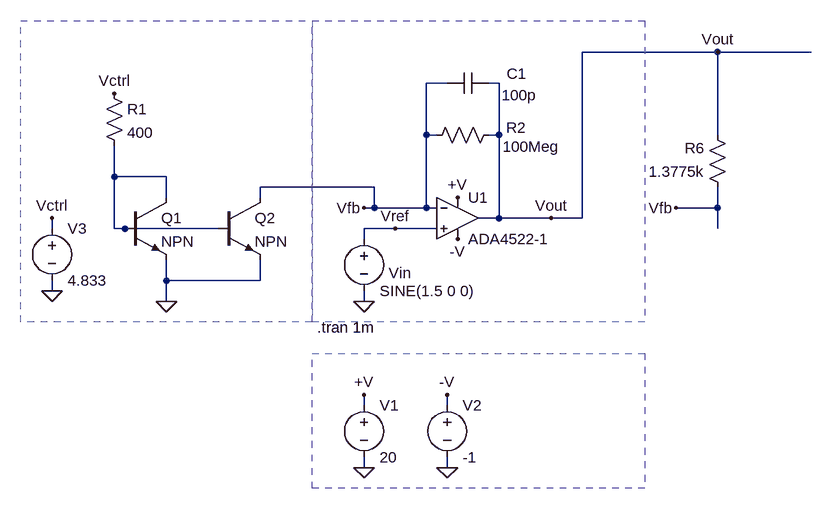
[diagram p0: schematic current_mirror_ctrl_EA.asc]
current_mirror_ctrl_EA.asc, the LTspice schematic file:
Version 4
SHEET 1 1624 700
WIRE 976 -1360 768 -1360
WIRE 1120 -1360 976 -1360
WIRE 560 -1312 528 -1312
WIRE 640 -1312 624 -1312
WIRE 528 -1232 528 -1312
WIRE 544 -1232 528 -1232
WIRE 640 -1232 640 -1312
WIRE 640 -1232 624 -1232
WIRE 976 -1232 976 -1360
WIRE 48 -1168 48 -1216
WIRE 128 -1168 48 -1168
WIRE 448 -1152 272 -1152
WIRE 128 -1136 128 -1168
WIRE 272 -1136 272 -1152
WIRE 448 -1120 448 -1152
WIRE 448 -1120 432 -1120
WIRE 528 -1120 528 -1232
WIRE 528 -1120 448 -1120
WIRE 544 -1120 528 -1120
WIRE 976 -1120 976 -1152
WIRE 976 -1120 912 -1120
WIRE 640 -1104 640 -1232
WIRE 640 -1104 608 -1104
WIRE 720 -1104 640 -1104
WIRE 768 -1104 768 -1360
WIRE 768 -1104 720 -1104
WIRE -48 -1088 -48 -1104
WIRE 48 -1088 48 -1168
WIRE 64 -1088 48 -1088
WIRE 208 -1088 64 -1088
WIRE 480 -1088 432 -1088
WIRE 544 -1088 480 -1088
WIRE 976 -1088 976 -1120
WIRE 432 -1072 432 -1088
WIRE 128 -1008 128 -1040
WIRE 272 -1008 272 -1040
WIRE 272 -1008 128 -1008
WIRE -48 -992 -48 -1008
WIRE 128 -976 128 -1008
WIRE 432 -976 432 -992
WIRE 432 -816 432 -832
WIRE 560 -816 560 -832
WIRE 432 -720 432 -736
WIRE 560 -720 560 -736
FLAG 432 -832 +V
FLAG 432 -720 0
FLAG 432 -976 0
FLAG 576 -1136 +V
FLAG 560 -832 -V
FLAG 576 -1072 -V
FLAG 560 -720 0
FLAG 128 -976 0
FLAG 720 -1104 Vout
FLAG 976 -1360 Vout
FLAG 912 -1120 Vfb
FLAG 48 -1296 Vctrl
FLAG 432 -1120 Vfb
FLAG 480 -1088 Vref
FLAG -48 -992 0
FLAG -48 -1104 Vctrl
SYMBOL voltage 432 -832 R0
WINDOW 123 0 0 Left 2
WINDOW 39 0 0 Left 2
SYMATTR InstName V1
SYMATTR Value 20
SYMBOL voltage 432 -1088 R0
WINDOW 123 24 146 Left 2
WINDOW 39 24 125 Left 2
WINDOW 0 38 68 Left 2
SYMATTR InstName Vin
SYMATTR Value SINE(1.5 0 0)
SYMBOL res 640 -1248 R90
WINDOW 0 20 -26 VBottom 2
WINDOW 3 18 -49 VTop 2
SYMATTR InstName R2
SYMATTR Value 100Meg
SYMBOL Opamps\\ADA4522-1 576 -1168 R0
SYMATTR InstName U1
SYMBOL voltage 560 -832 R0
WINDOW 123 24 146 Left 2
WINDOW 39 24 125 Left 2
SYMATTR InstName V2
SYMATTR Value -1
SYMBOL npn 64 -1136 R0
SYMATTR InstName Q1
SYMBOL npn 208 -1136 R0
SYMATTR InstName Q2
SYMBOL res 992 -1136 R180
WINDOW 0 36 76 Left 2
WINDOW 3 36 40 Left 2
SYMATTR InstName R6
SYMATTR Value 1.3775k
SYMBOL res 32 -1312 R0
SYMATTR InstName R1
SYMATTR Value 400
SYMBOL cap 624 -1328 R90
WINDOW 0 17 -43 VBottom 2
WINDOW 3 19 -47 VTop 2
SYMATTR InstName C1
SYMATTR Value 100p
SYMBOL voltage -48 -1104 R0
WINDOW 123 0 0 Left 2
WINDOW 39 0 0 Left 2
SYMATTR InstName V3
SYMATTR Value 4.833
TEXT 360 -936 Left 2 !.tran 1m
RECTANGLE Normal 864 -944 352 -1408 2
RECTANGLE Normal 864 -688 352 -896 2
RECTANGLE Normal -96 -1408 352 -944 2

The netlist it stands for:
* current_mirror_ctrl_EA.asc
V1 +V 0 20
Vin Vref 0 SINE(1.5 0 0)
R2 Vout Vfb 100Meg
XU1 Vref Vfb +V -V Vout ADA4522-1  ; pins In+ In- V+ V- OUT
V2 -V 0 -1
Q1 N001 N001 0 0 NPN
Q2 Vfb N001 0 0 NPN
R6 Vfb Vout 1.3775k
R1 Vctrl N001 400
C1 Vout Vfb 100p
V3 Vctrl 0 4.833
.model NPN NPN
.model PNP PNP
.lib standard.bjt
.tran 1m
.backanno
.end